# EasyEDA Pro project ProPrj_声音与振动的家庭安防预警系统_2026-04-17.epro

# Schematic Schematic1
Assembly Variant: Basic; Board Name: Board1; Create Date: 2026-04-17; Page Name: P1; Project Name: 声音与振动的家庭安防预警系统; Schematic Name: Schematic1; Update Date: 2026-04-17; BladeWidth: 10; Company: 嘉立创EDA; Page Size: A4; RegionStart: 1; ShowBorder: 1; TitleBlock: 1; TitleBlockPosition: 3; Version: V1.0; XRegionCount: 6; YRegionCount: 4
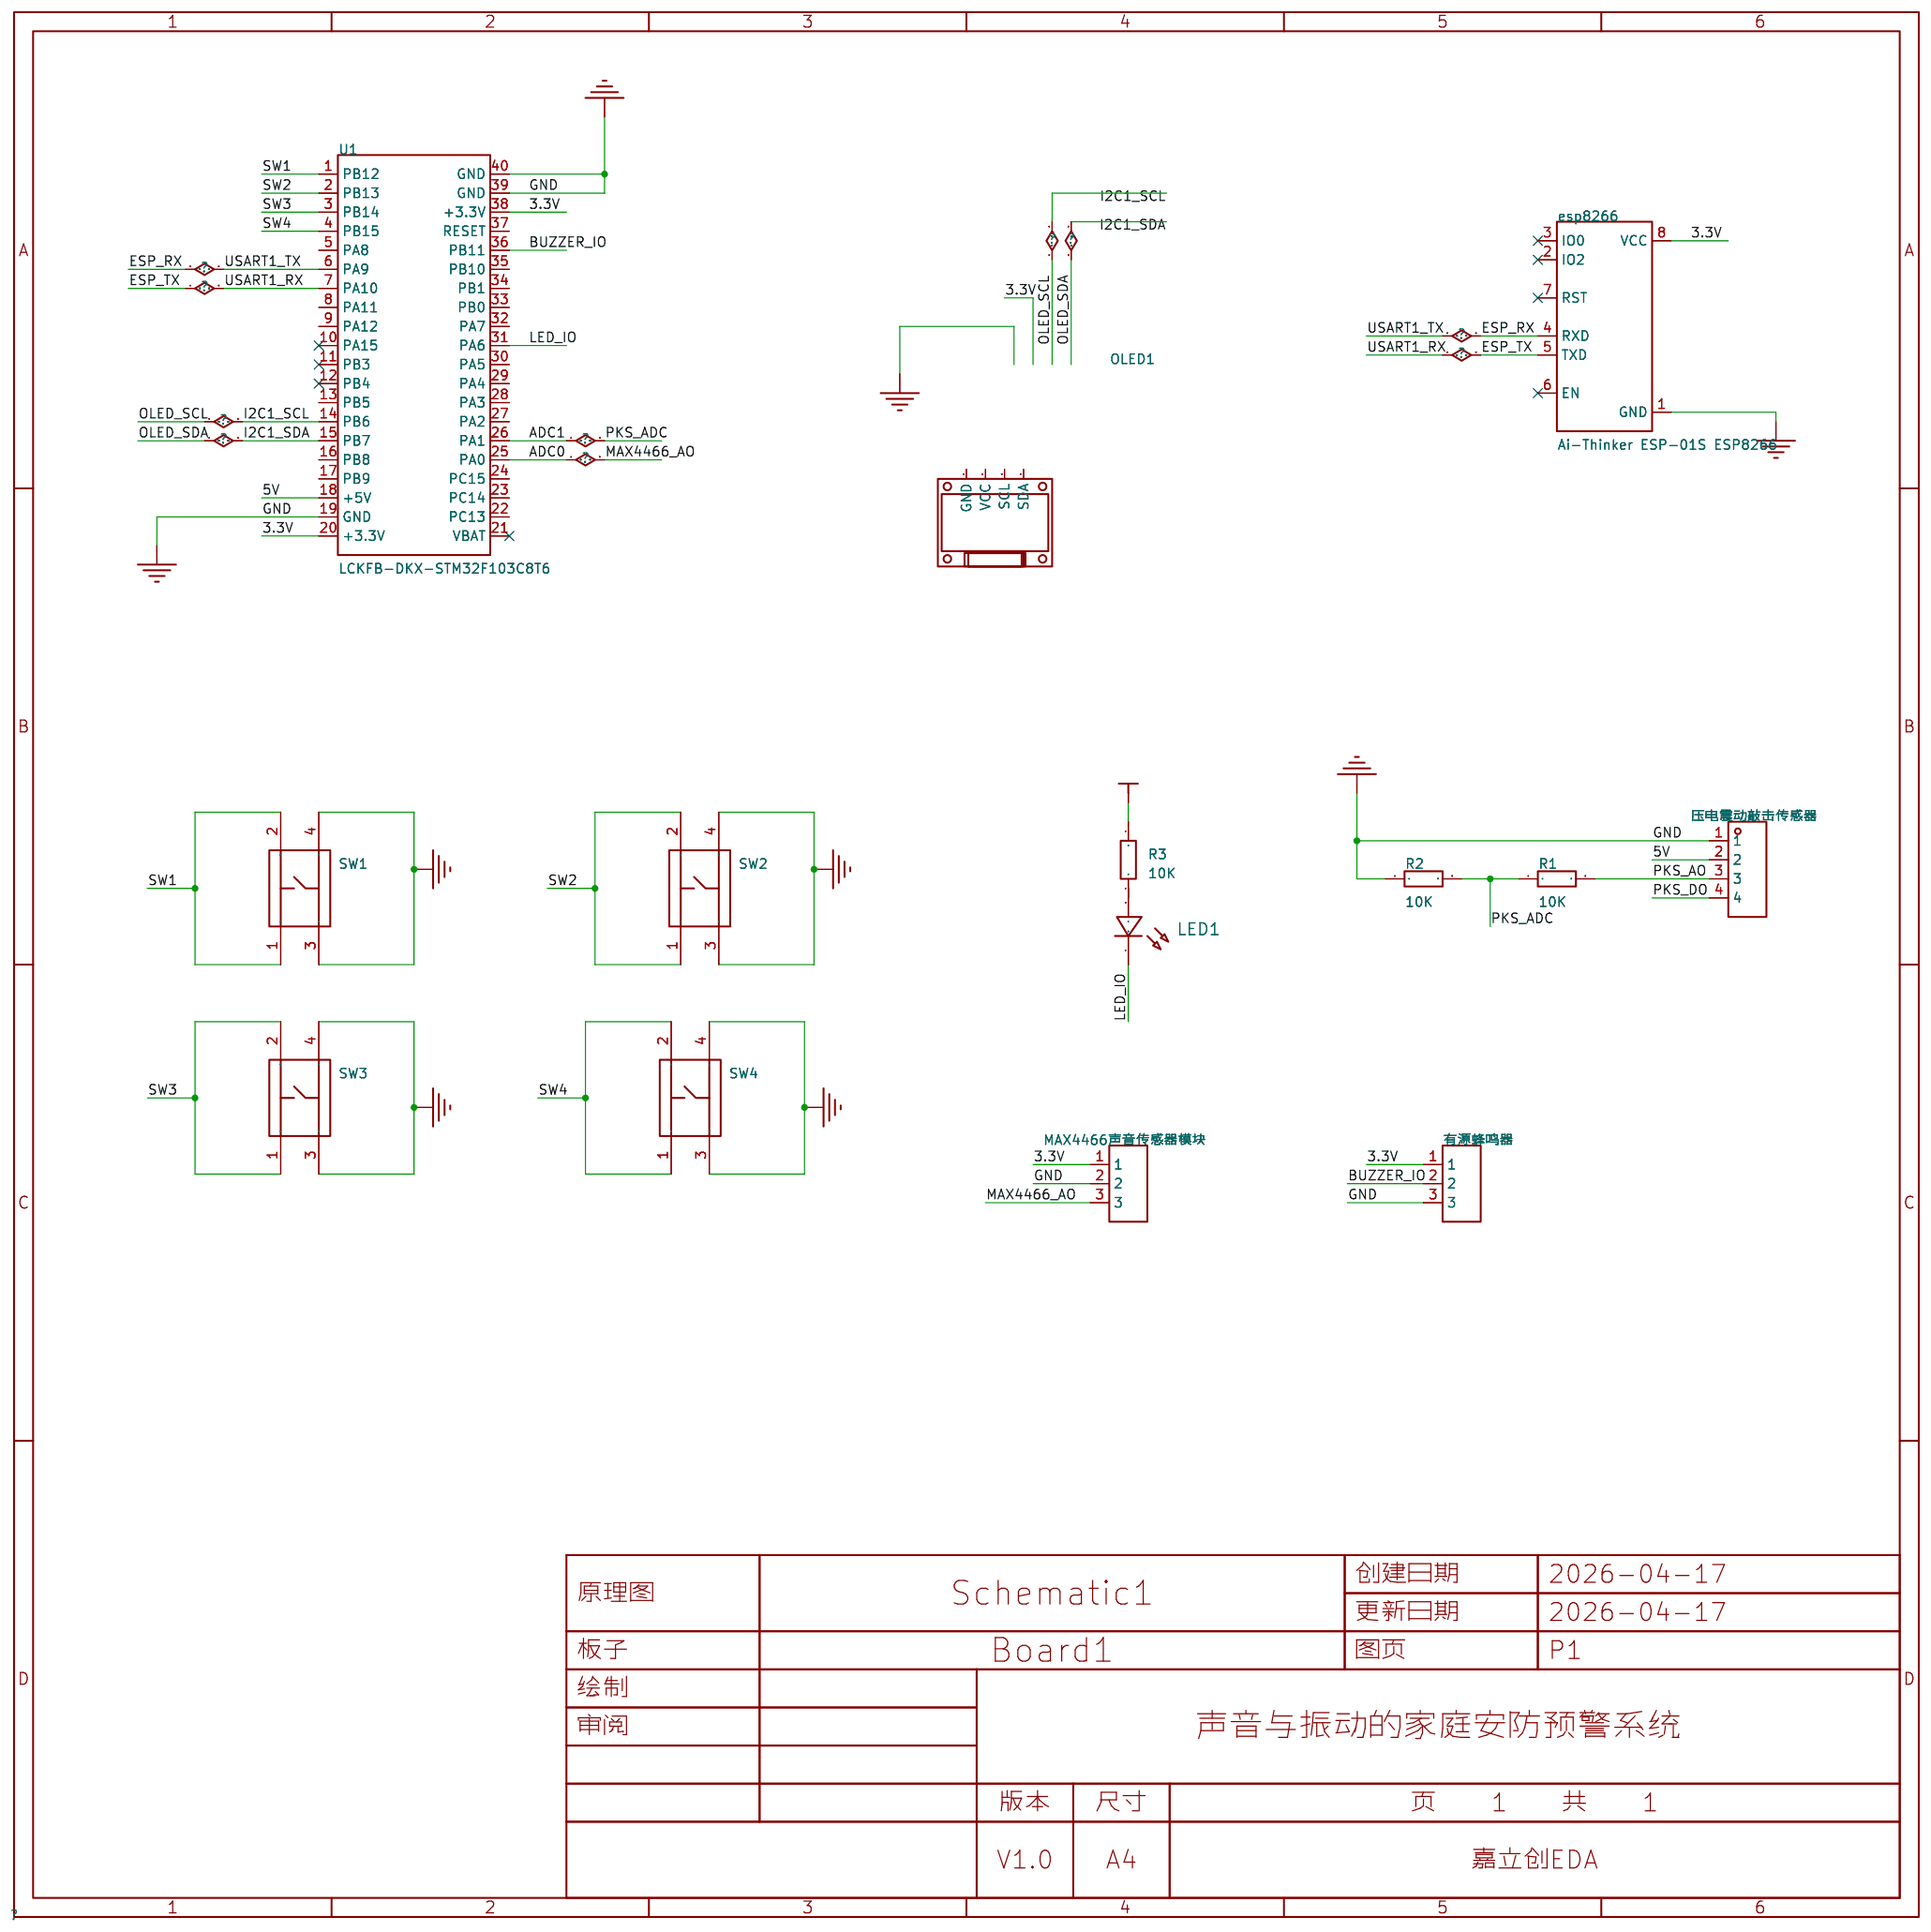
[diagram p0: schematic sheet]

## Parts
esp8266  Ai-Thinker ESP-01S ESP8266  [WIFIM-TH_8P-L24.7-W14.4-P2.54]
LED1  -  [LED_0805]
MAX4466声音传感器模块  -  [HDR-TH_3P-P2.54-V-F]
OLED1  -  [0.96OLED_4P]
R1  10K  [R0805]
R2  10K  [R0805]
R3  10K  [R0805]
SW1  K2-1102DP-C4SW-04  [KEY-TH_4P-L6.0-W6.0-P4.50-LS6.50]
SW2  K2-1102DP-C4SW-04  [KEY-TH_4P-L6.0-W6.0-P4.50-LS6.50]
SW3  K2-1102DP-C4SW-04  [KEY-TH_4P-L6.0-W6.0-P4.50-LS6.50]
SW4  K2-1102DP-C4SW-04  [KEY-TH_4P-L6.0-W6.0-P4.50-LS6.50]
U1  LCKFB-DKX-STM32F103C8T6  [CONN-TH_L53.3-W22.9_STM32F103C8T6-CARD]
压电震动敲击传感器  -  [HDR-TH_4P-P2.54-V-F]
有源蜂鸣器  PM254V-11-03-H85  [HDR-TH_3P-P2.54-V-F]

## Library data of the parts
esp8266 = Ai-Thinker ESP-01S ESP8266: Supplier Part: C17606792; Manufacturer: Ai-Thinker(安信可); JLCPCB Part Class: Extended Part; Datasheet: https://item.szlcsc.com/datasheet/Ai-Thinker%2520ESP-01S%2520ESP8266/18736031.html; Supplier: LCSC
LED1 = LED_0805-R: Supplier Footprint: 0805
MAX4466声音传感器模块 = HDR-F_2.54_1x3P: Supplier Part: C541850; Supplier Footprint: 插件
OLED1 = 0.96OLED模块_4P: Supplier Footprint: 插件
R1-R3 = Res_0805: Supplier Footprint: 0805
SW1-SW4 = K2-1102DP-C4SW-04: 电路结构:单刀单掷;按钮形状:圆形按钮;作用力:2.5N;安装方式:直插;开关长度:6mm;开关宽度:6mm;开关高度:5mm;触点电流:50mA;额定电压:12V;带灯:-;工作寿命:10万次;; LCSC Part Name: 轻触按键开关6*6*5; Supplier Part: C110153; Manufacturer: 韩国韩荣; Supplier Footprint: 插件-4P,6x6mm; JLCPCB Part Class: Extended Part; Datasheet: https://item.szlcsc.com/datasheet/K2-1102DP-C4SW-04/111374.html; Supplier: LCSC; Circuit: 单刀单掷; Actuator Style: 圆形按钮; Operating Force: 2.5N; Mounting Type: 直插; Length: 6mm; Width: 6mm; Switch Height: 5mm; Contact Current: 50mA; Voltage Rating: 12V; Life: 10万次; Operating Temperature: -25℃~+85℃
U1 = LCKFB-DKX-STM32F103C8T6: 搭载Contex M3内核,程序存储容量64KB,RAM总容量20KB,最高72MHz主频,提供高效的计算能力和稳定的运行环境。; LCSC Part Name: 立创·地阔星-STM32F103C8T6开发板; Supplier Part: C22396880; Manufacturer: 立创开发板; JLCPCB Part Class: Extended Part; Datasheet: https://item.szlcsc.com/datasheet/LCKFB-DKX-STM32F103C8T6/24005615.html; Supplier: LCSC
压电震动敲击传感器 = HDR-F_2.54_1x4P: Supplier Part: C2718488; Supplier Footprint: 插件
有源蜂鸣器 = PM254V-11-03-H85: 插孔结构:1x3P;间距:2.54mm;行距:-;圆孔/方孔:方孔;安装方式:直插;排数:单排;总孔位数:3P;额定电流:3A;插孔方向:顶部;塑高:8.5mm;触头材质:黄铜;触头镀层:-;工作温度:-40℃~+105℃;; LCSC Part Name: 1x3P 间距:2.54mm 直插; Supplier Part: C541850; Manufacturer: XFCN(兴飞); Supplier Footprint: 插件,P=2.54mm; JLCPCB Part Class: Extended Part; Datasheet: https://item.szlcsc.com/datasheet/PM254V-11-03-H85/562471.html; Supplier: LCSC; Holes Structure: 1x3P; Pitch: 2.54mm; Circular Hole / Square Hole: 方孔; Mounting Type: 直插; Number of Rows: 单排; Number of Positions: 3P; Current Rating: 3A; Holes Direction: 顶部; Insulation Height: 8.5mm; Contact Material: 黄铜; Operating Temperature: -40℃~+105℃

## Nets
3.3V: esp8266.8(VCC) MAX4466声音传感器模块.1 R3.2 U1.20(+3.3V) U1.38(+3.3V) 有源蜂鸣器.1
5V: U1.18(+5V) 压电震动敲击传感器.2
GND: esp8266.1(GND) MAX4466声音传感器模块.2 R2.1 SW1.3 SW1.4 SW2.3 SW2.4 SW3.3 SW3.4 SW4.3 SW4.4 U1.19(GND) U1.39(GND) U1.40(GND) 压电震动敲击传感器.1 有源蜂鸣器.3
ADC0: MAX4466声音传感器模块.3 U1.25(PA0)
ADC1: R1.1 R2.2 U1.26(PA1)
BUZZER_IO: U1.36(PB11) 有源蜂鸣器.2
ESP_RX: esp8266.4(RXD) U1.6(PA9)
ESP_TX: esp8266.5(TXD) U1.7(PA10)
I2C1_SCL: U1.14(PB6)
I2C1_SDA: U1.15(PB7)
LED_IO: LED1.1(C) U1.31(PA6)
PKS_AO: R1.2 压电震动敲击传感器.3
PKS_DO: 压电震动敲击传感器.4
SW1: SW1.1 SW1.2 U1.1(PB12)
SW2: SW2.1 SW2.2 U1.2(PB13)
SW3: SW3.1 SW3.2 U1.3(PB14)
SW4: SW4.1 SW4.2 U1.4(PB15)
$1N48: LED1.2(A) R3.1

Not connected (* = marked no-connect by the designer): esp8266 2(IO2)* 3(IO0)* 6(EN)* 7(RST)*; OLED1 1(GND) 2(VCC) 3(SCL) 4(SDA); U1 5(PA8) 8(PA11) 9(PA12) 10(PA15)* 11(PB3)* 12(PB4)* 13(PB5) 16(PB8) 17(PB9) 21(VBAT)* 22(PC13) 23(PC14) 24(PC15) 27(PA2) 28(PA3) 29(PA4) 30(PA5) 32(PA7) 33(PB0) 34(PB1) 35(PB10) 37(RESET)

# Board PCB1
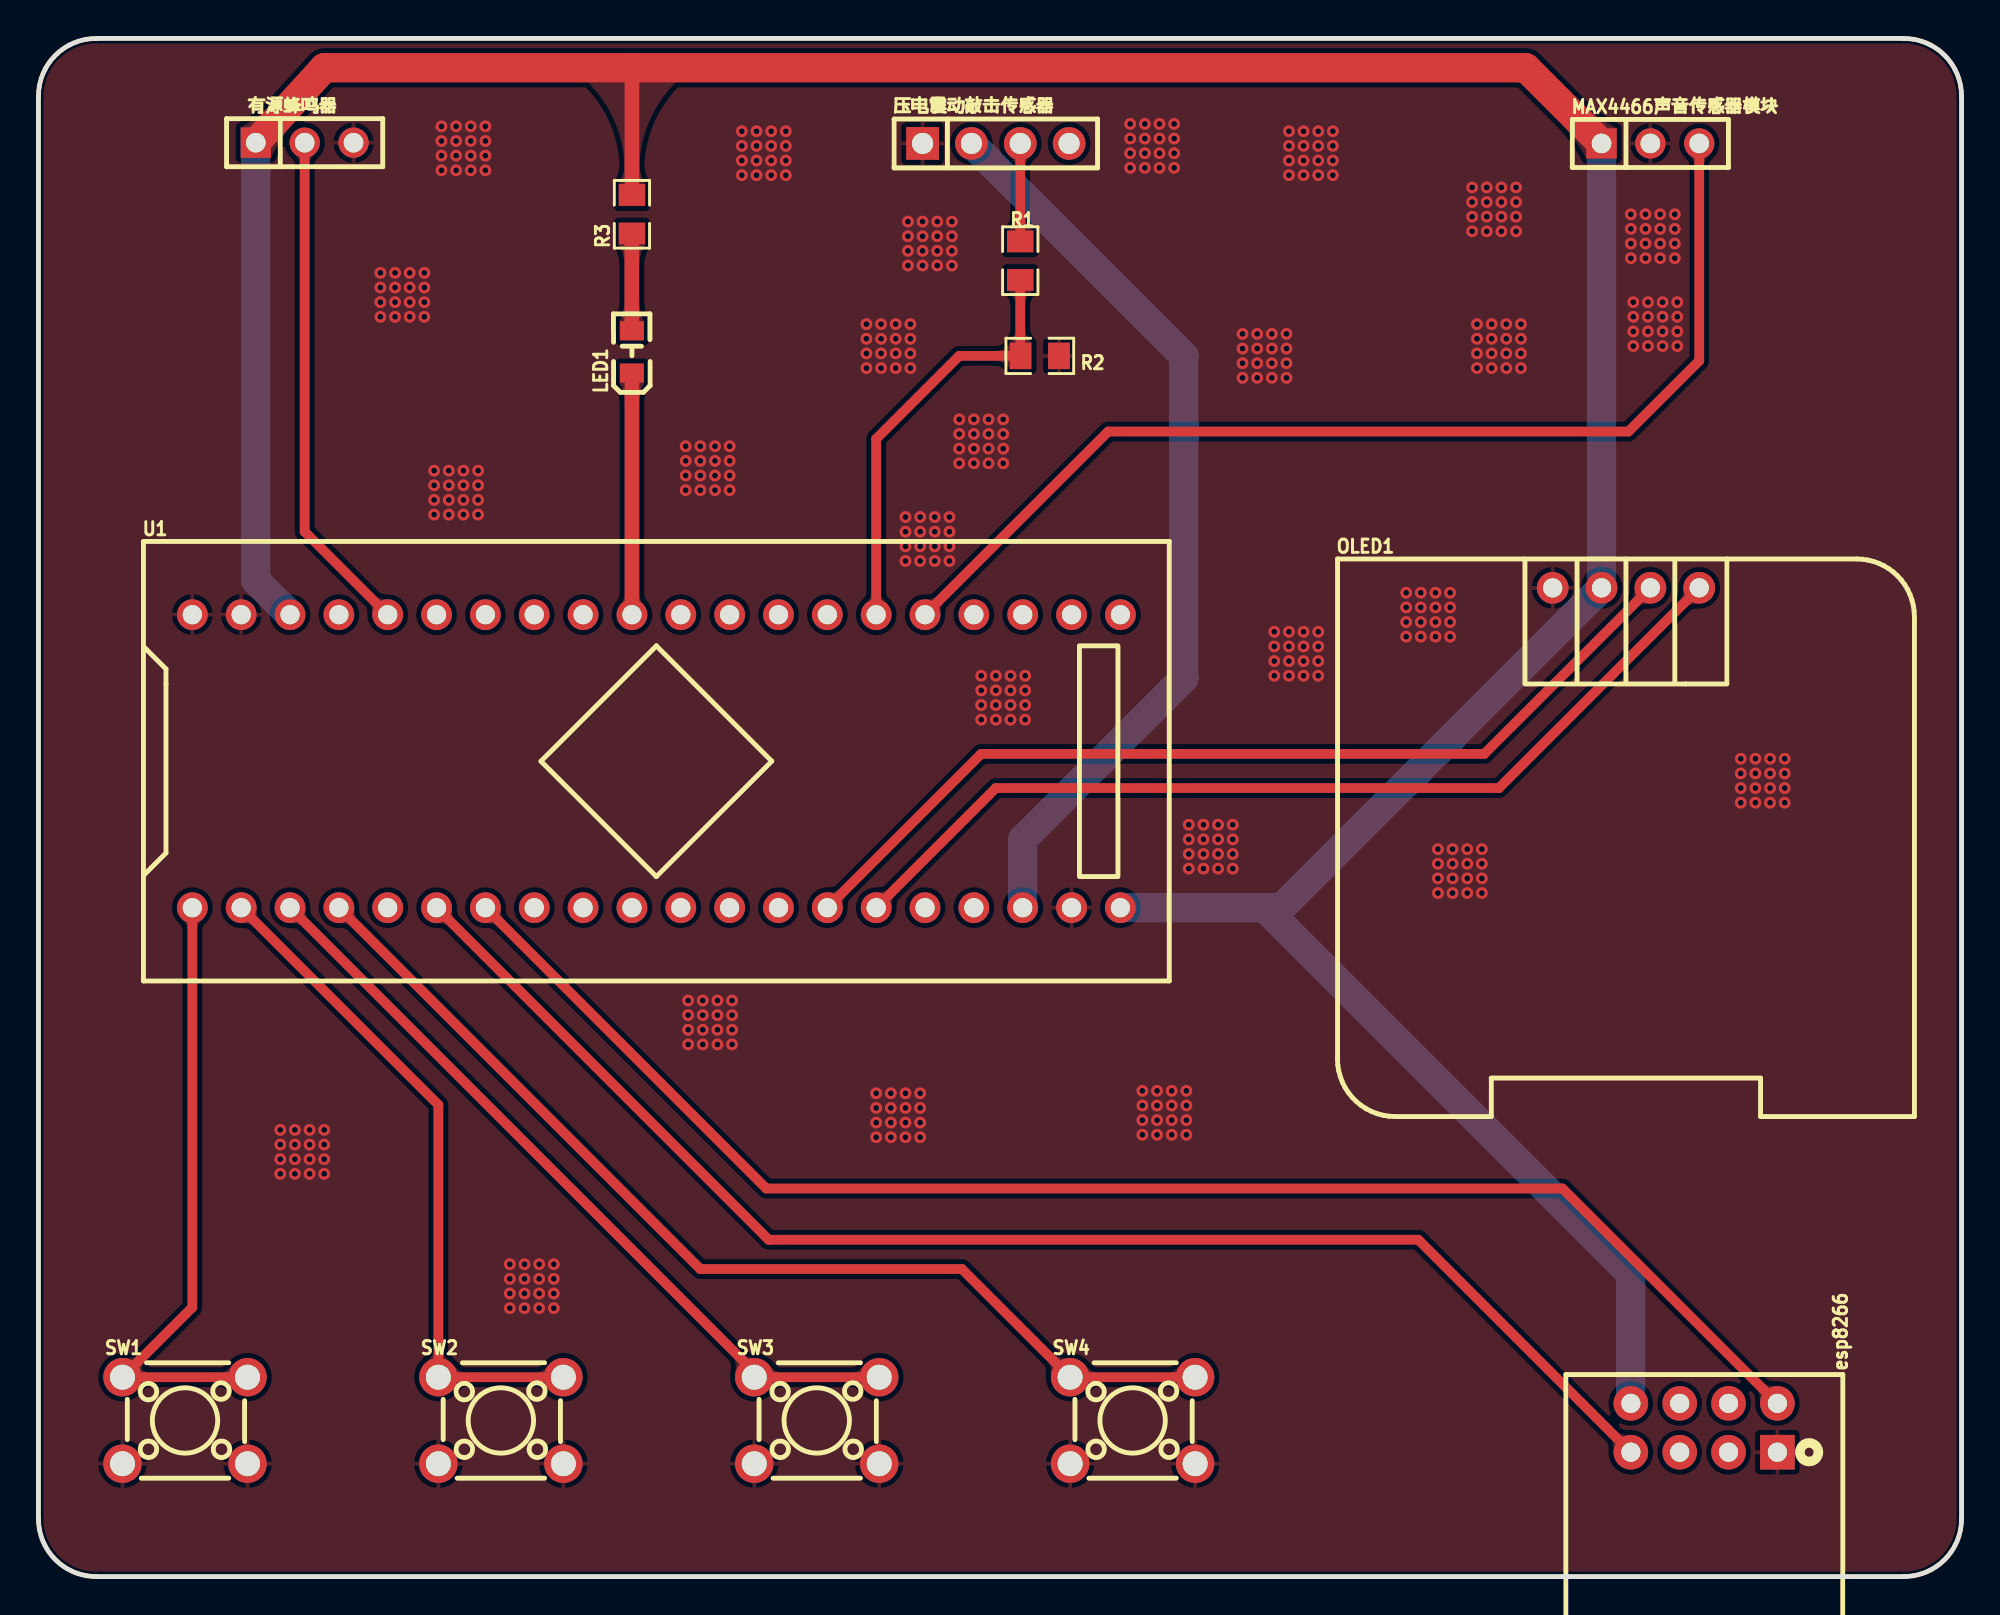
[diagram p1: board, top side]
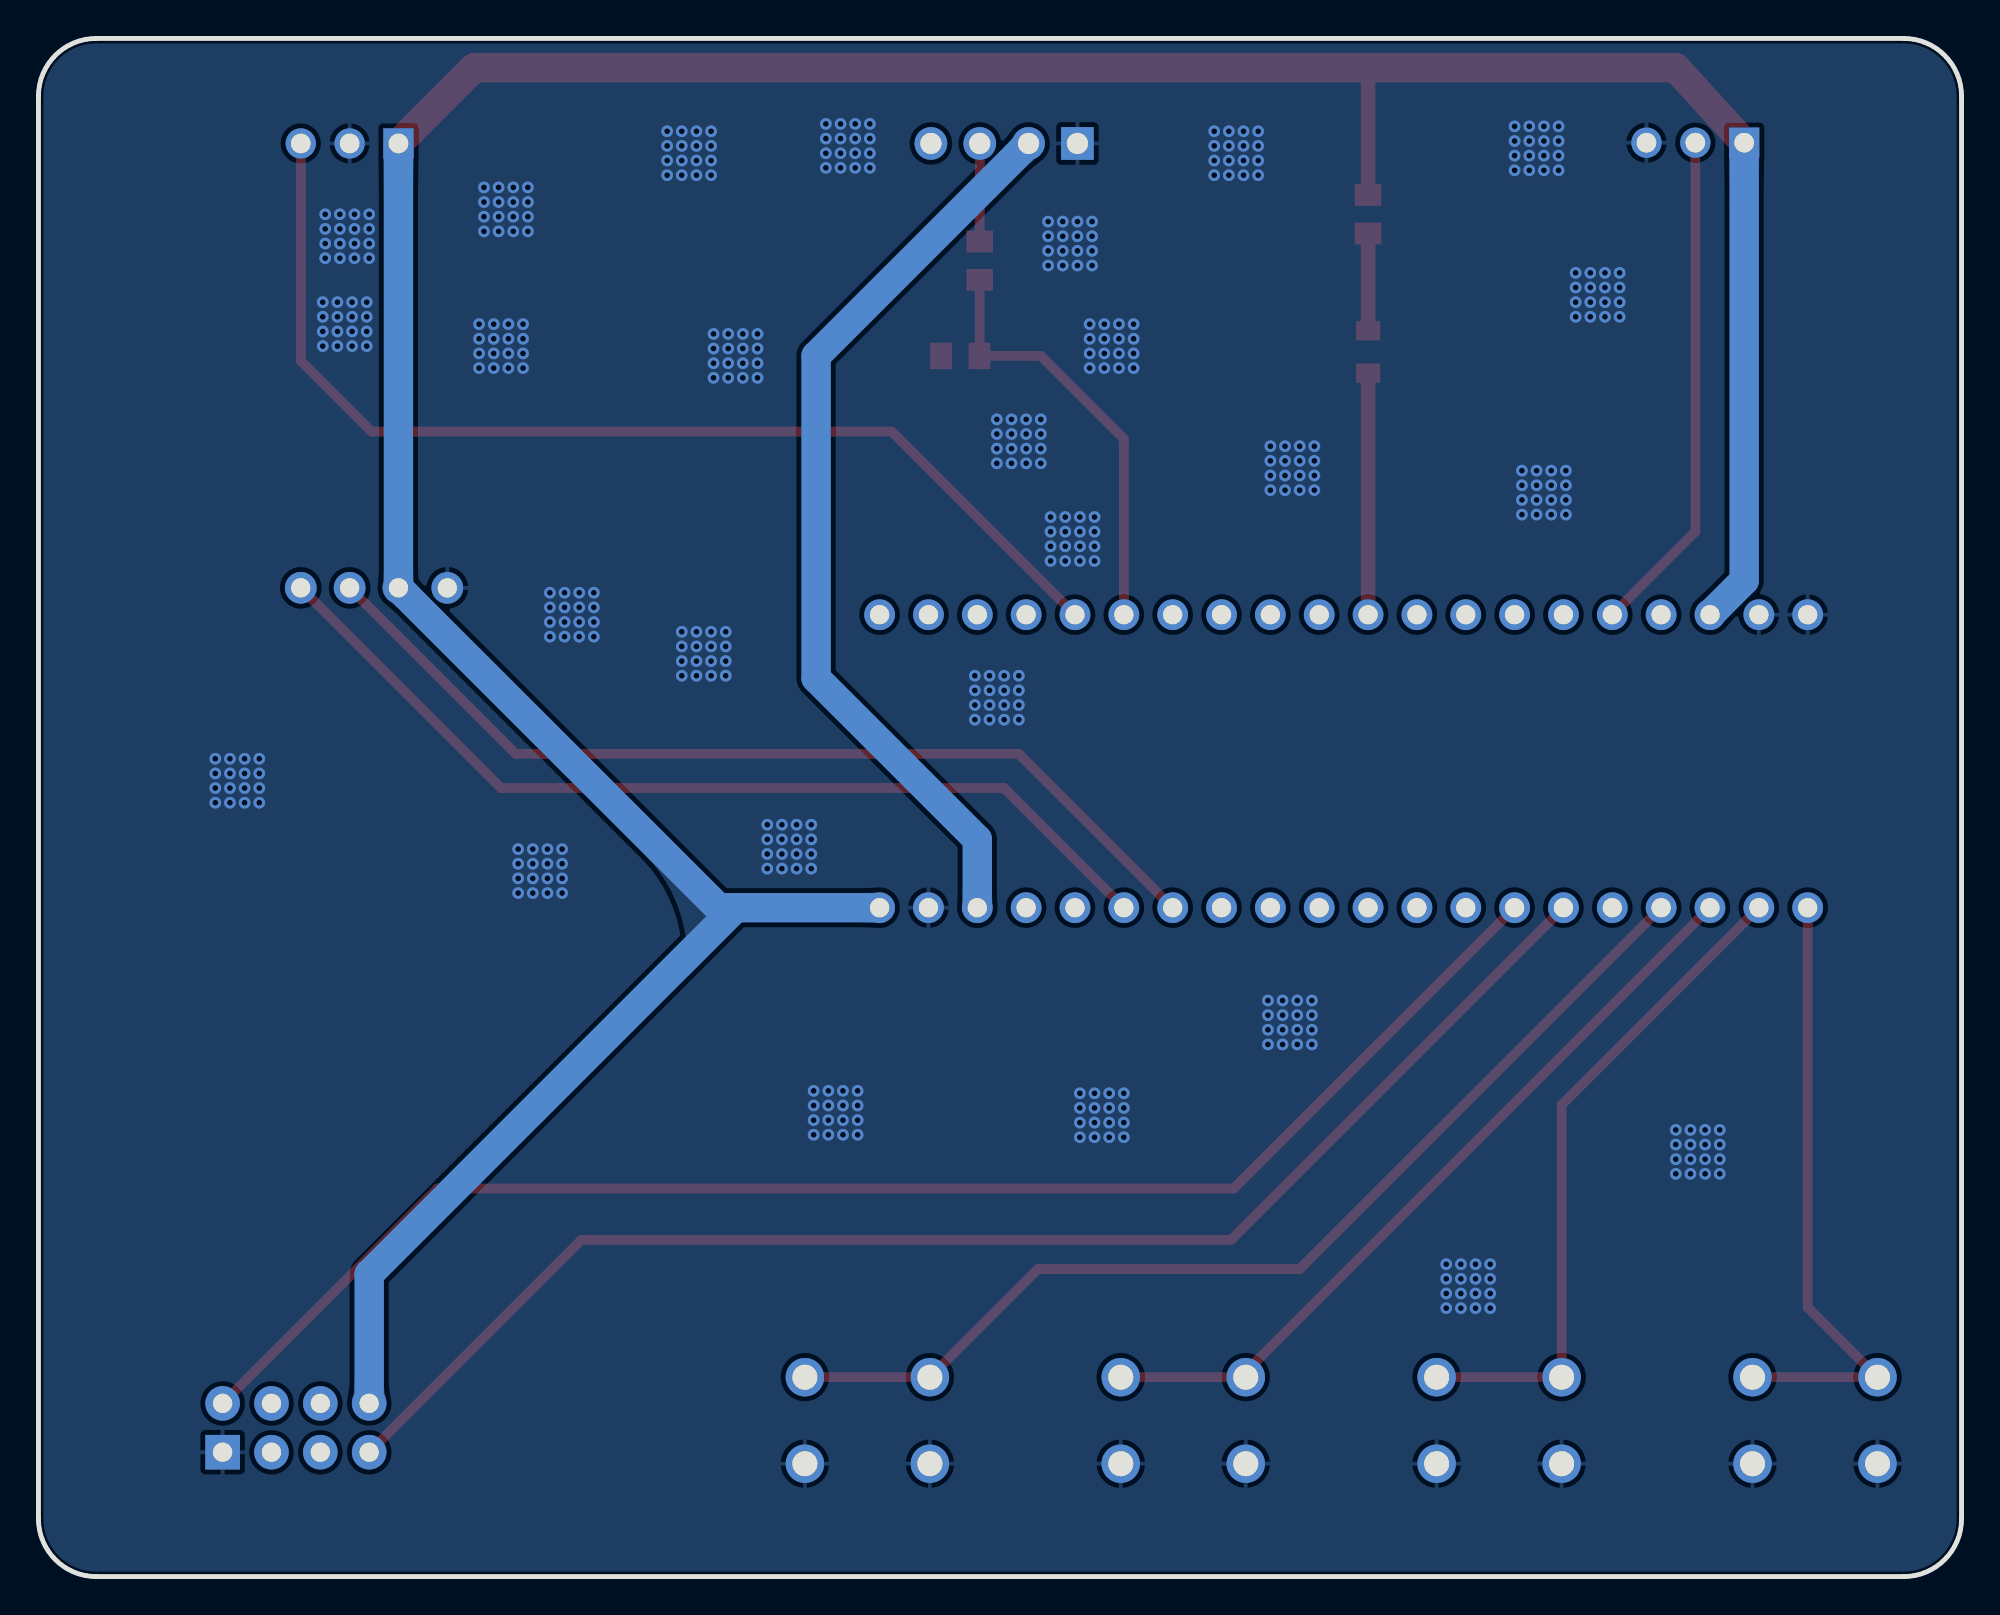
[diagram p2: board, bottom side, seen from below]

Outline 100 x 80 mm; copper layers: Top Layer, Bottom Layer. Coordinates in mm from the lower left corner of the outline.
Outline path: 0,77 0,3 arc(0.88,0.88) 3,0 97,0 arc(99.12,0.88) 100,3 100,77 arc(99.12,79.12) 97,80 3,80 arc(0.88,79.12) 0,77
Stack: Top Layer 0.035mm / Dielectric1 1.51mm FR4 er 4.5 / Bottom Layer 0.035mm

## Design rules (mm)
spacing copperThickness1oz (default): track to track 0.102, other pairs 0.152 to 0.3
spacing copperThickness2oz: track to track 0.203, other pairs 0.152 to 0.3
track width copperThickness1oz (default): min 0.127, default 0.254, max 2.54
track width copperThickness2oz: min 0.203, default 0.254, max 2.54
differential pair differentialPair (default): width min 0.127, default 0.254, max 2.54; gap min 0.152, default 0.152
net GND uses copperRegion

## Placement (name value [footprint] x y rotation side)
esp8266  Ai-Thinker ESP-01S ESP8266  [WIFIM-TH_8P-L24.7-W14.4-P2.54]  86.61 7.74 270 top
LED1  -  [LED_0805]  30.86 63.74 90 top
MAX4466声音传感器模块  -  [HDR-TH_3P-P2.54-V-F]  83.82 74.54 0 top
OLED1  -  [0.96OLED_4P]  82.55 51.42 0 top
R1  10K  [R0805]  51.05 68.44 90 top
R2  10K  [R0805]  52.07 63.49 180 top
R3  10K  [R0805]  30.86 70.86 90 top
SW1  K2-1102DP-C4SW-04  [KEY-TH_4P-L6.0-W6.0-P4.50-LS6.50]  7.62 8.12 0 top
SW2  K2-1102DP-C4SW-04  [KEY-TH_4P-L6.0-W6.0-P4.50-LS6.50]  24.05 8.12 0 top
SW3  K2-1102DP-C4SW-04  [KEY-TH_4P-L6.0-W6.0-P4.50-LS6.50]  40.47 8.12 0 top
SW4  K2-1102DP-C4SW-04  [KEY-TH_4P-L6.0-W6.0-P4.50-LS6.50]  56.9 8.12 0 top
U1  LCKFB-DKX-STM32F103C8T6  [CONN-TH_L53.3-W22.9_STM32F103C8T6-CARD]  32.13 42.41 0 top
压电震动敲击传感器  -  [HDR-TH_4P-P2.54-V-F]  49.78 74.54 0 top
有源蜂鸣器  PM254V-11-03-H85  [HDR-TH_3P-P2.54-V-F]  13.84 74.58 0 top

## Footprints (pads in the part's own frame, mm; a bottom-side part is the same pattern mirrored in y, then rotated)
0.96OLED_4P
  round 1.65 hole 1: 1(-3.81,-0.002) 2(-1.27,0.002) 3(1.27,0.002) 4(3.81,0.002)
CONN-TH_L53.3-W22.9_STM32F103C8T6-CARD
  round 1.6 hole 1: 1(-24.13,-7.62) 2(-21.59,-7.62) 3(-19.05,-7.62) 4(-16.51,-7.62) 5(-13.97,-7.62) 6(-11.43,-7.62) 7(-8.89,-7.62) 8(-6.35,-7.62) 9(-3.81,-7.62) 10(-1.27,-7.62) 11(1.27,-7.62) 12(3.81,-7.62) 13(6.35,-7.62) 14(8.89,-7.62) 15(11.43,-7.62) 16(13.97,-7.62) 17(16.51,-7.62) 18(19.05,-7.62) 19(21.59,-7.62) 20(24.13,-7.62) 21(24.13,7.62) 22(21.59,7.62) 23(19.05,7.62) 24(16.51,7.62) 25(13.97,7.62) 26(11.43,7.62) 27(8.89,7.62) 28(6.35,7.62) 29(3.81,7.62) 30(1.27,7.62) 31(-1.27,7.62) 32(-3.81,7.62) 33(-6.35,7.62) 34(-8.89,7.62) 35(-11.43,7.62) 36(-13.97,7.62) 37(-16.51,7.62) 38(-19.05,7.62) 39(-21.59,7.62) 40(-24.13,7.62)
HDR-TH_3P-P2.54-V-F
  rect 1.575x1.575 hole 1.02: 1(-2.54,0)
  round 1.575 hole 1.02: 2(0,0) 3(2.54,0)
HDR-TH_4P-P2.54-V-F
  rect 1.7x1.7 hole 1.1: 1(-3.81,0)
  round 1.7 hole 1.1: 2(-1.27,0) 3(1.27,0) 4(3.81,0)
KEY-TH_4P-L6.0-W6.0-P4.50-LS6.50
  round 2 hole 1.3: 1(-3.25,2.25) 2(3.25,2.25) 3(-3.25,-2.25) 4(3.25,-2.25)
LED_0805
  rect 1x1.25 smd: 1(-1.15,0.005) 2(1.05,0.005)
R0805
  rect 1.133x1.377 smd: 1(-1,0) 2(1,0)
WIFIM-TH_8P-L24.7-W14.4-P2.54
  rect 1.8x1.8 hole 1: 1(1.27,3.81)
  round 1.8 hole 1: 2(1.27,1.27) 3(1.27,-1.27) 4(1.27,-3.81) 5(-1.27,3.81) 6(-1.27,1.27) 7(-1.27,-1.27) 8(-1.27,-3.81)

## Nets
3.3V: esp8266.8 MAX4466声音传感器模块.1 OLED1.2 R3.2 U1.20 U1.38 有源蜂鸣器.1
5V: U1.18 压电震动敲击传感器.2
GND: esp8266.1 MAX4466声音传感器模块.2 OLED1.1 R2.1 SW1.3 SW1.4 SW2.3 SW2.4 SW3.3 SW3.4 SW4.3 SW4.4 U1.19 U1.39 U1.40 压电震动敲击传感器.1 有源蜂鸣器.3
ADC0: MAX4466声音传感器模块.3 U1.25
ADC1: R1.1 R2.2 U1.26
BUZZER_IO: U1.36 有源蜂鸣器.2
ESP_RX: esp8266.4 U1.6
ESP_TX: esp8266.5 U1.7
I2C1_SCL: OLED1.3 U1.14
I2C1_SDA: OLED1.4 U1.15
LED_IO: LED1.1 U1.31
PKS_AO: R1.2 压电震动敲击传感器.3
PKS_DO: 压电震动敲击传感器.4
SW1: SW1.1 SW1.2 U1.1
SW2: SW2.1 SW2.2 U1.2
SW3: SW3.1 SW3.2 U1.3
SW4: SW4.1 SW4.2 U1.4
$1N48: LED1.2 R3.1

Pads without a net: esp8266 2 3 6 7; U1 5 8 9 10 11 12 13 16 17 21 22 23 24 27 28 29 30 32 33 34 35 37

## Via types
v1: diameter 0.61, hole 0.305, Top Layer to Bottom Layer, 432 vias

## Routing (per net, layer and track width the routed paths; a pad name or vN(x,y) marks a point on that pad's centre or on a via; arc(x,y) is an arc through that point)
3.3V: length 193.9
  Top Layer w0.762: 30.89,78.48 30.86,78.45 R3.2
  Top Layer w1.524: MAX4466声音传感器模块.1 77.34,78.48 14.86,78.48 有源蜂鸣器.1
  Bottom Layer w1.524: U1.20 63.75,34.79 ; 63.75,34.79 82.8,15.73 esp8266.8 ; 63.75,34.79 64.64,34.79 OLED1.2 MAX4466声音传感器模块.1 ; 有源蜂鸣器.1 11.3,51.81 U1.38
5V: length 47.8
  Bottom Layer w1.524: 压电震动敲击传感器.2 59.56,63.49 59.56,46.73 51.18,38.34 U1.18
GND:
  vias: v1(12.57,23.23) v1(12.57,22.47) v1(12.57,21.71) v1(12.57,20.94) v1(13.33,23.23) v1(13.33,22.47) v1(13.33,21.71) v1(13.33,20.94) v1(14.1,23.23) v1(14.1,22.47) v1(14.1,21.71) v1(14.1,20.94) v1(14.86,23.23) v1(14.86,22.47) v1(14.86,21.71) v1(14.86,20.94) v1(17.78,67.81) v1(17.78,67.05) v1(17.78,66.28) v1(17.78,65.52) v1(18.54,67.81) v1(18.54,67.05) v1(18.54,66.28) v1(18.54,65.52) v1(19.3,67.81) v1(19.3,67.05) v1(19.3,66.28) v1(19.3,65.52) v1(20.07,67.81) v1(20.07,67.05) v1(20.07,66.28) v1(20.07,65.52) v1(20.57,57.52) v1(20.57,56.76) v1(20.57,56) v1(20.57,55.23) v1(20.95,75.43) v1(20.95,74.67) v1(20.95,73.9) v1(20.95,73.14) v1(21.34,57.52) v1(21.34,56.76) v1(21.34,56) v1(21.34,55.23) v1(21.72,75.43) v1(21.72,74.67) v1(21.72,73.9) v1(21.72,73.14) v1(22.1,57.52) v1(22.1,56.76) v1(22.1,56) v1(22.1,55.23) v1(22.48,75.43) v1(22.48,74.67) v1(22.48,73.9) v1(22.48,73.14) v1(22.86,57.52) v1(22.86,56.76) v1(22.86,56) v1(22.86,55.23) v1(23.24,75.43) v1(23.24,74.67) v1(23.24,73.9) v1(23.24,73.14) v1(24.51,16.25) v1(24.51,15.48) v1(24.51,14.72) v1(24.51,13.96) v1(25.27,16.25) v1(25.27,15.48) v1(25.27,14.72) v1(25.27,13.96) v1(26.03,16.25) v1(26.03,15.48) v1(26.03,14.72) v1(26.03,13.96) v1(26.8,16.25) v1(26.8,15.48) v1(26.8,14.72) v1(26.8,13.96) v1(33.66,58.79) v1(33.66,58.03) v1(33.66,57.27) v1(33.66,56.5) v1(33.78,29.96) v1(33.78,29.2) v1(33.78,28.44) v1(33.78,27.68) v1(34.42,58.79) v1(34.42,58.03) v1(34.42,57.27) v1(34.42,56.5) v1(34.54,29.96) v1(34.54,29.2) v1(34.54,28.44) v1(34.54,27.68) v1(35.18,58.79) v1(35.18,58.03) v1(35.18,57.27) v1(35.18,56.5) v1(35.31,29.96) v1(35.31,29.2) v1(35.31,28.44) v1(35.31,27.68) v1(35.94,58.79) v1(35.94,58.03) v1(35.94,57.27) v1(35.94,56.5) v1(36.07,29.96) v1(36.07,29.2) v1(36.07,28.44) v1(36.07,27.68) v1(36.58,75.17) v1(36.58,74.41) v1(36.58,73.65) v1(36.58,72.89) v1(37.34,75.17) v1(37.34,74.41) v1(37.34,73.65) v1(37.34,72.89) v1(38.1,75.17) v1(38.1,74.41) v1(38.1,73.65) v1(38.1,72.89) v1(38.86,75.17) v1(38.86,74.41) v1(38.86,73.65) v1(38.86,72.89) v1(43.05,65.14) v1(43.05,64.38) v1(43.05,63.62) v1(43.05,62.86) v1(43.56,25.14) v1(43.56,24.37) v1(43.56,23.61) v1(43.56,22.85) v1(43.81,65.14) v1(43.81,64.38) v1(43.81,63.62) v1(43.81,62.86) v1(44.32,25.14) v1(44.32,24.37) v1(44.32,23.61) v1(44.32,22.85) v1(44.58,65.14) v1(44.58,64.38) v1(44.58,63.62) v1(44.58,62.86) v1(45.09,55.11) v1(45.09,54.35) v1(45.09,53.58) v1(45.09,52.82) v1(45.09,25.14) v1(45.09,24.37) v1(45.09,23.61) v1(45.09,22.85) v1(45.21,70.47) v1(45.21,69.71) v1(45.21,68.95) v1(45.21,68.19) v1(45.34,65.14) v1(45.34,64.38) v1(45.34,63.62) v1(45.34,62.86) v1(45.85,55.11) v1(45.85,54.35) v1(45.85,53.58) v1(45.85,52.82) v1(45.85,25.14) v1(45.85,24.37) v1(45.85,23.61) v1(45.85,22.85) v1(45.97,70.47) v1(45.97,69.71) v1(45.97,68.95) v1(45.97,68.19) v1(46.61,55.11) v1(46.61,54.35) v1(46.61,53.58) v1(46.61,52.82) v1(46.74,70.47) v1(46.74,69.71) v1(46.74,68.95) v1(46.74,68.19) v1(47.37,55.11) v1(47.37,54.35) v1(47.37,53.58) v1(47.37,52.82) v1(47.5,70.47) v1(47.5,69.71) v1(47.5,68.95) v1(47.5,68.19) v1(47.88,60.19) v1(47.88,59.43) v1(47.88,58.66) v1(47.88,57.9) v1(48.64,60.19) v1(48.64,59.43) v1(48.64,58.66) v1(48.64,57.9) v1(49.02,46.85) v1(49.02,46.09) v1(49.02,45.33) v1(49.02,44.57) v1(49.4,60.19) v1(49.4,59.43) v1(49.4,58.66) v1(49.4,57.9) v1(49.78,46.85) v1(49.78,46.09) v1(49.78,45.33) v1(49.78,44.57) v1(50.16,60.19) v1(50.16,59.43) v1(50.16,58.66) v1(50.16,57.9) v1(50.55,46.85) v1(50.55,46.09) v1(50.55,45.33) v1(50.55,44.57) v1(51.31,46.85) v1(51.31,46.09) v1(51.31,45.33) v1(51.31,44.57) v1(56.77,75.56) v1(56.77,74.79) v1(56.77,74.03) v1(56.77,73.27) v1(57.4,25.26) v1(57.4,24.5) v1(57.4,23.74) v1(57.4,22.98) v1(57.53,75.56) v1(57.53,74.79) v1(57.53,74.03) v1(57.53,73.27) v1(58.17,25.26) v1(58.17,24.5) v1(58.17,23.74) v1(58.17,22.98) v1(58.29,75.56) v1(58.29,74.79) v1(58.29,74.03) v1(58.29,73.27) v1(58.93,25.26) v1(58.93,24.5) v1(58.93,23.74) v1(58.93,22.98) v1(59.06,75.56) v1(59.06,74.79) v1(59.06,74.03) v1(59.06,73.27) v1(59.69,25.26) v1(59.69,24.5) v1(59.69,23.74) v1(59.69,22.98) v1(59.82,39.11) v1(59.82,38.34) v1(59.82,37.58) v1(59.82,36.82) v1(60.58,39.11) v1(60.58,38.34) v1(60.58,37.58) v1(60.58,36.82) v1(61.34,39.11) v1(61.34,38.34) v1(61.34,37.58) v1(61.34,36.82) v1(62.1,39.11) v1(62.1,38.34) v1(62.1,37.58) v1(62.1,36.82) v1(62.61,64.63) v1(62.61,63.87) v1(62.61,63.11) v1(62.61,62.35) v1(63.37,64.63) v1(63.37,63.87) v1(63.37,63.11) v1(63.37,62.35) v1(64.13,64.63) v1(64.13,63.87) v1(64.13,63.11) v1(64.13,62.35) v1(64.26,49.14) v1(64.26,48.38) v1(64.26,47.61) v1(64.26,46.85) v1(64.9,64.63) v1(64.9,63.87) v1(64.9,63.11) v1(64.9,62.35) v1(65.02,75.17) v1(65.02,74.41) v1(65.02,73.65) v1(65.02,72.89) v1(65.02,49.14) v1(65.02,48.38) v1(65.02,47.61) v1(65.02,46.85) v1(65.79,75.17) v1(65.79,74.41) v1(65.79,73.65) v1(65.79,72.89) v1(65.79,49.14) v1(65.79,48.38) v1(65.79,47.61) v1(65.79,46.85) v1(66.55,75.17) v1(66.55,74.41) v1(66.55,73.65) v1(66.55,72.89) v1(66.55,49.14) v1(66.55,48.38) v1(66.55,47.61) v1(66.55,46.85) v1(67.31,75.17) v1(67.31,74.41) v1(67.31,73.65) v1(67.31,72.89) v1(71.12,51.17) v1(71.12,50.41) v1(71.12,49.65) v1(71.12,48.89) v1(71.88,51.17) v1(71.88,50.41) v1(71.88,49.65) v1(71.88,48.89) v1(72.64,51.17) v1(72.64,50.41) v1(72.64,49.65) v1(72.64,48.89) v1(72.77,37.84) v1(72.77,37.07) v1(72.77,36.31) v1(72.77,35.55) v1(73.41,51.17) v1(73.41,50.41) v1(73.41,49.65) v1(73.41,48.89) v1(73.53,37.84) v1(73.53,37.07) v1(73.53,36.31) v1(73.53,35.55) v1(74.29,37.84) v1(74.29,37.07) v1(74.29,36.31) v1(74.29,35.55) v1(74.55,72.25) v1(74.55,71.49) v1(74.55,70.73) v1(74.55,69.97) v1(74.8,65.14) v1(74.8,64.38) v1(74.8,63.62) v1(74.8,62.86) v1(75.06,37.84) v1(75.06,37.07) v1(75.06,36.31) v1(75.06,35.55) v1(75.31,72.25) v1(75.31,71.49) v1(75.31,70.73) v1(75.31,69.97) v1(75.56,65.14) v1(75.56,64.38) v1(75.56,63.62) v1(75.56,62.86) v1(76.07,72.25) v1(76.07,71.49) v1(76.07,70.73) v1(76.07,69.97) v1(76.33,65.14) v1(76.33,64.38) v1(76.33,63.62) v1(76.33,62.86) v1(76.84,72.25) v1(76.84,71.49) v1(76.84,70.73) v1(76.84,69.97) v1(77.09,65.14) v1(77.09,64.38) v1(77.09,63.62) v1(77.09,62.86) v1(82.8,70.86) v1(82.8,70.09) v1(82.8,69.33) v1(82.8,68.57) v1(82.93,66.28) v1(82.93,65.52) v1(82.93,64.76) v1(82.93,64) v1(83.57,70.86) v1(83.57,70.09) v1(83.57,69.33) v1(83.57,68.57) v1(83.69,66.28) v1(83.69,65.52) v1(83.69,64.76) v1(83.69,64) v1(84.33,70.86) v1(84.33,70.09) v1(84.33,69.33) v1(84.33,68.57) v1(84.46,66.28) v1(84.46,65.52) v1(84.46,64.76) v1(84.46,64) v1(85.09,70.86) v1(85.09,70.09) v1(85.09,69.33) v1(85.09,68.57) v1(85.22,66.28) v1(85.22,65.52) v1(85.22,64.76) v1(85.22,64) v1(88.52,42.53) v1(88.52,41.77) v1(88.52,41.01) v1(88.52,40.25) v1(89.28,42.53) v1(89.28,41.77) v1(89.28,41.01) v1(89.28,40.25) v1(90.04,42.53) v1(90.04,41.77) v1(90.04,41.01) v1(90.04,40.25) v1(90.81,42.53) v1(90.81,41.77) v1(90.81,41.01) v1(90.81,40.25)
ADC0: length 57
  Top Layer w0.508: U1.25 55.63,59.55 82.68,59.55 86.36,63.24 MAX4466声音传感器模块.3
ADC1: length 22.4
  Top Layer w0.508: U1.26 43.56,59.17 47.88,63.49 R2.2 51.05,63.51 R1.1
BUZZER_IO: length 26.3
  Top Layer w0.508: 有源蜂鸣器.2 13.84,54.35 U1.36
ESP_RX: length 73.8
  Top Layer w0.508: U1.6 37.97,17.52 71.75,17.52 82.8,6.47
ESP_TX: length 77.9
  Top Layer w0.508: esp8266.5 79.25,20.18 37.85,20.18 U1.7
I2C1_SCL: length 49.7
  Top Layer w0.508: 41.02,34.79 49.02,42.79 75.18,42.79 OLED1.3
I2C1_SDA: length 49.7
  Top Layer w0.508: OLED1.4 75.94,41.01 49.78,41.01 U1.15
LED_IO: length 12.6
  Top Layer w0.762: LED1.1 30.86,62.59 U1.31
PKS_AO: length 5.1
  Top Layer w0.508: 压电震动敲击传感器.3 R1.2
SW1: length 32.4
  Top Layer w0.508: SW1.2 SW1.1 8,14 U1.1
SW2: length 35.2
  Top Layer w0.508: SW2.2 SW2.1 20.8,24.53 U1.2
SW3: length 40.9
  Top Layer w0.508: SW3.2 SW3.1 37.22,10.65 U1.3
SW4: length 54.6
  Top Layer w0.508: U1.4 34.42,15.99 48.02,15.99 SW4.1 SW4.2
$1N48: length 5.1
  Top Layer w0.762: R3.1 30.86,69.85 LED1.2

## Copper pours and planes (outline as drawn; the poured copper is in the pictures)
GND on Top Layer: -4.83,82.29 119.89,82.29 119.89,-6.23 -4.83,-6.23
GND on Bottom Layer: -16.26,92.83 142.88,92.83 142.88,-17.79 -16.26,-17.79

Small or netless copper shapes (teardrops, artwork), in the pictures only: 42 on Top Layer, 10 on Bottom Layer
